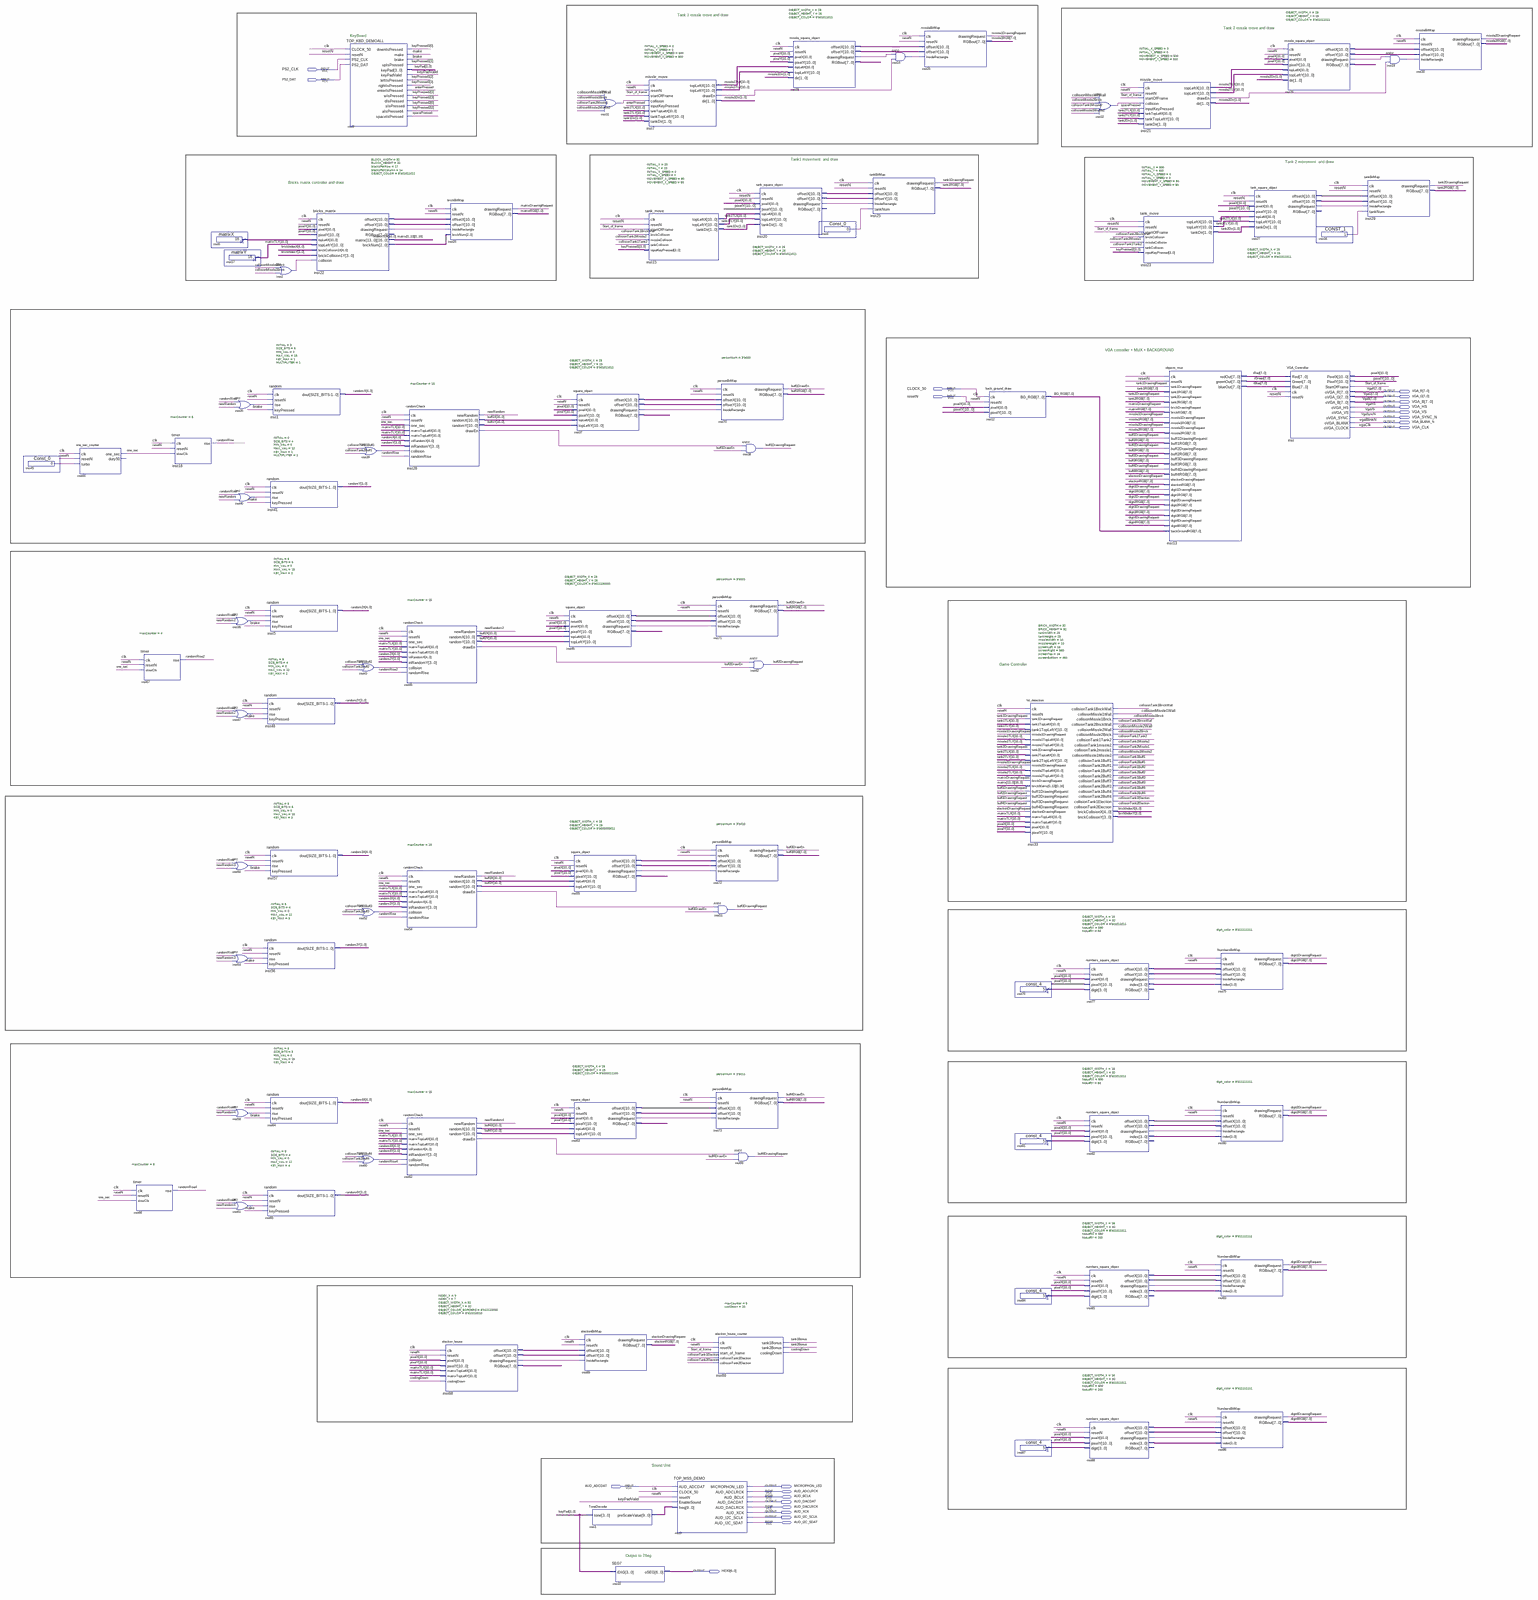
[diagram p0: schematic sheet, whole]
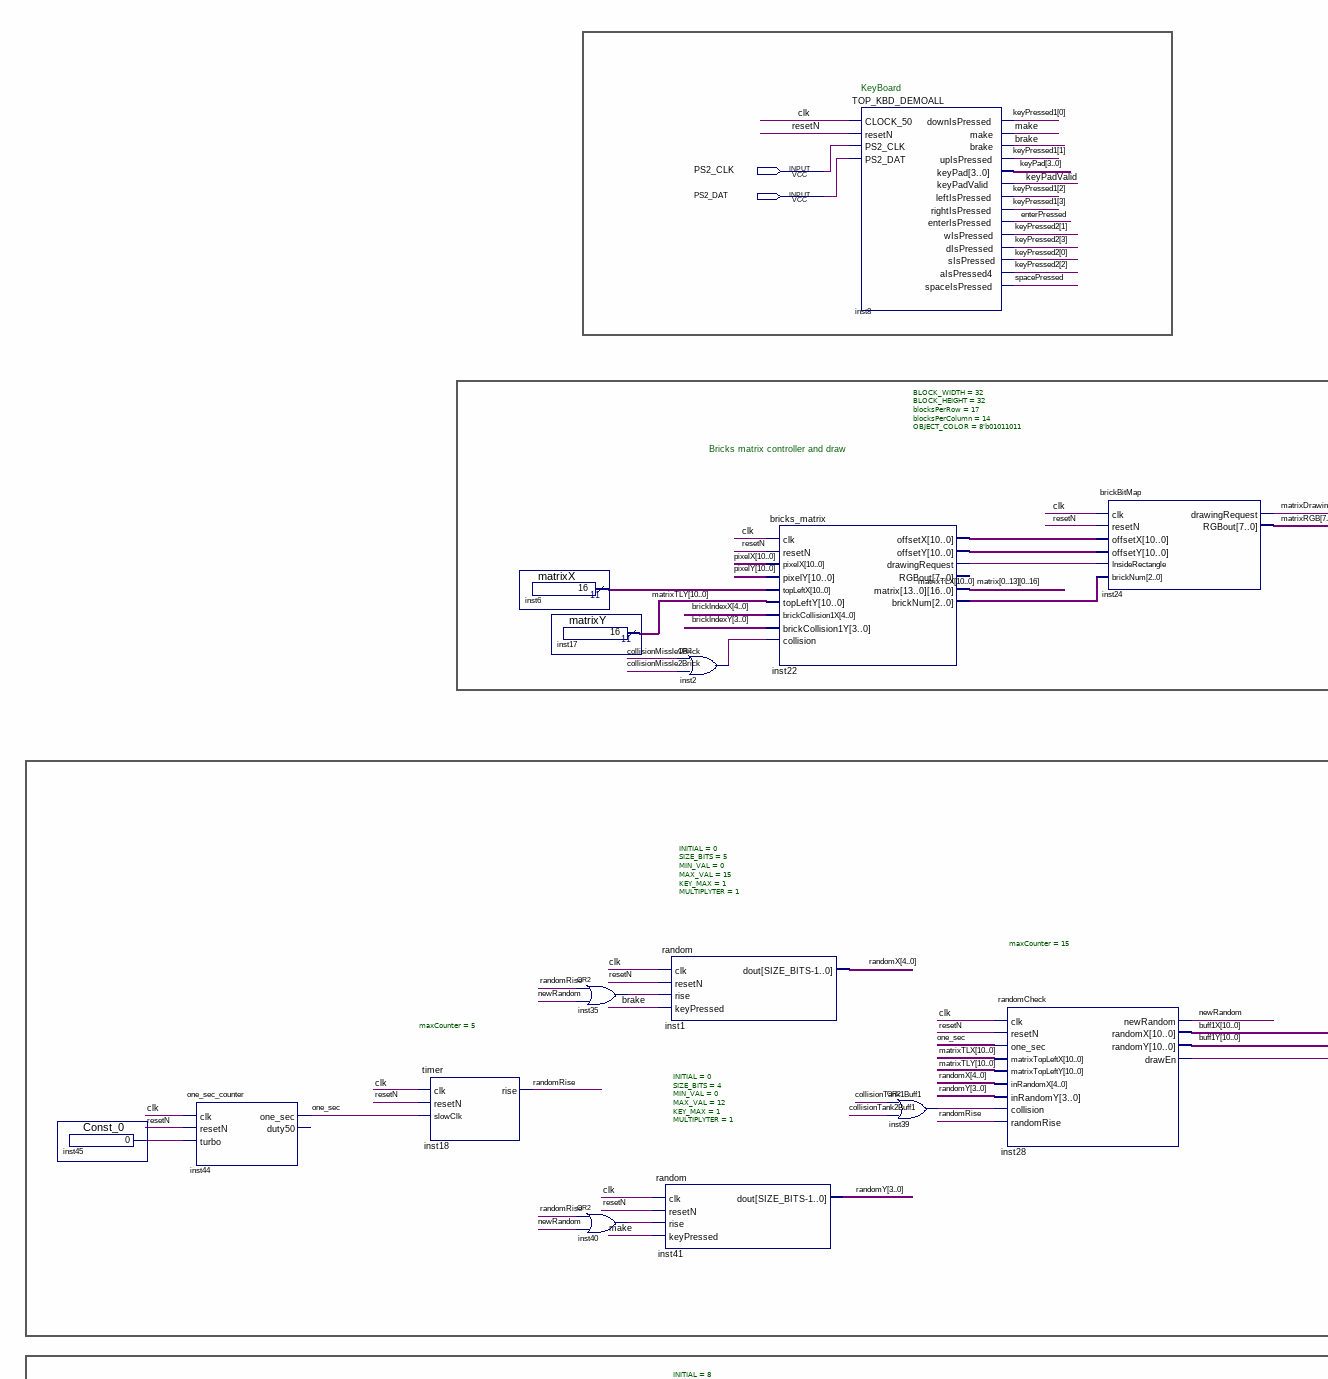
[diagram p1: schematic sheet, upper left part]
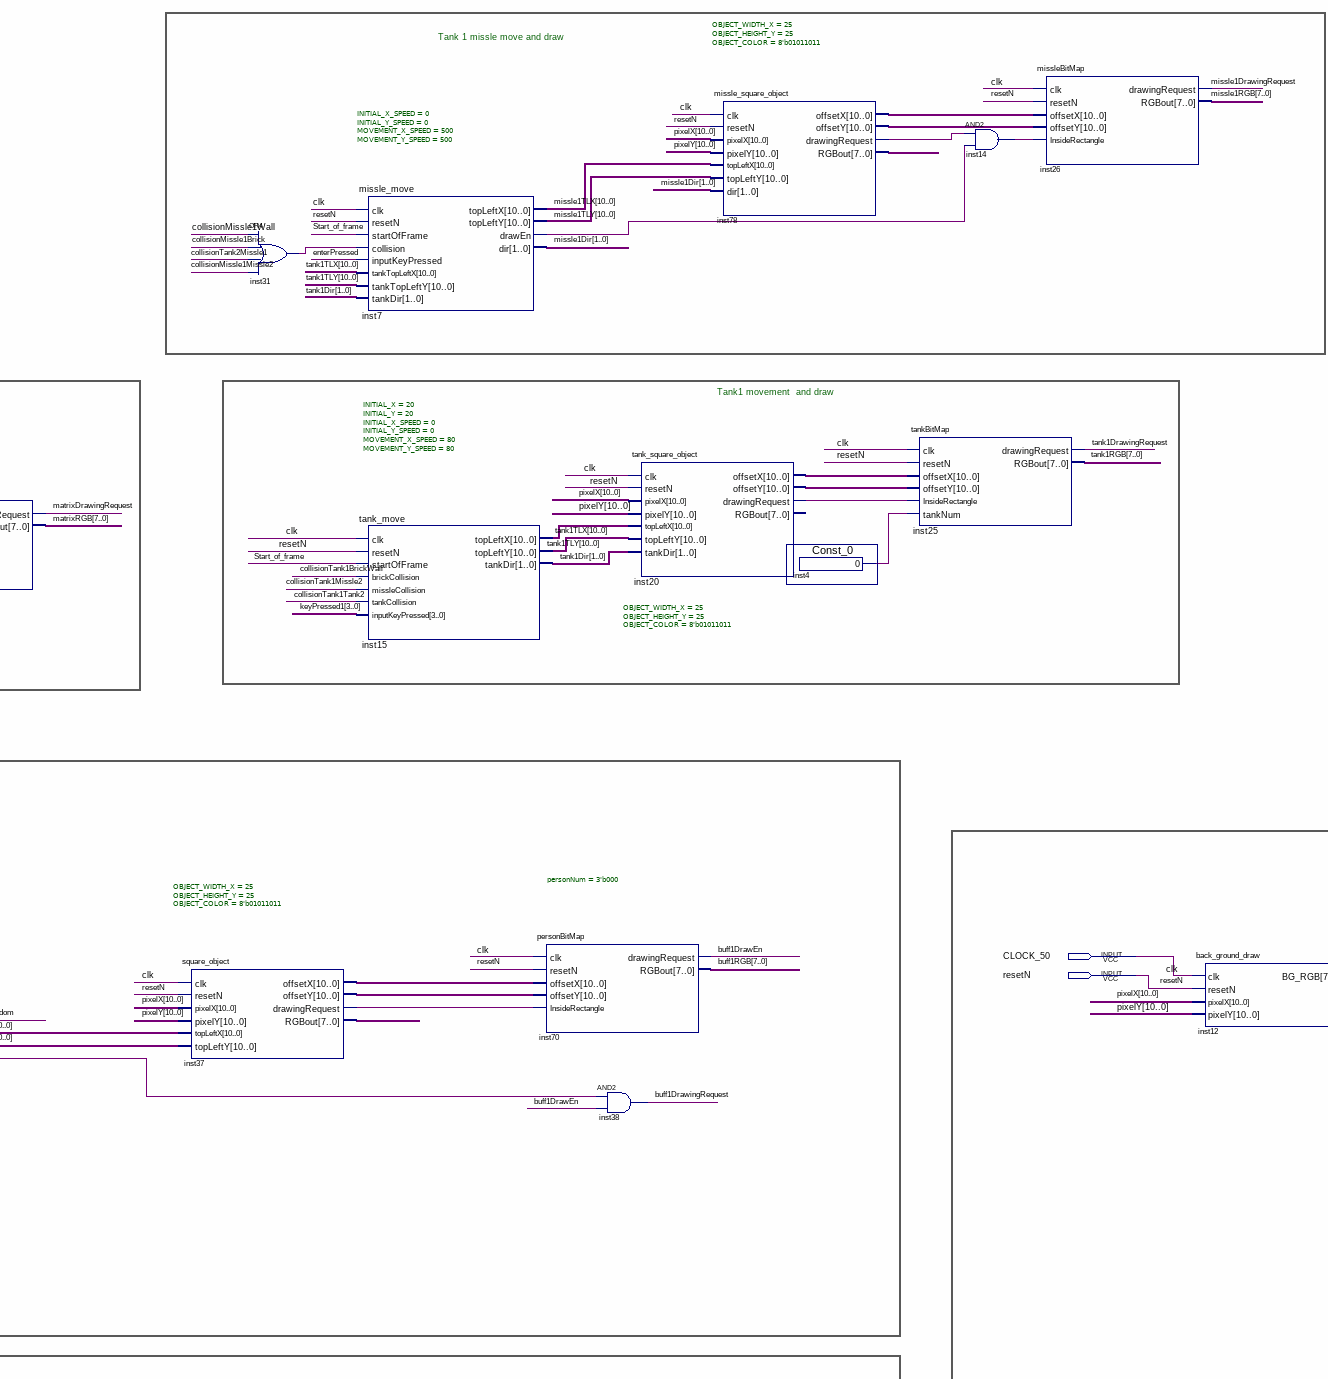
[diagram p2: schematic sheet, upper centre part]
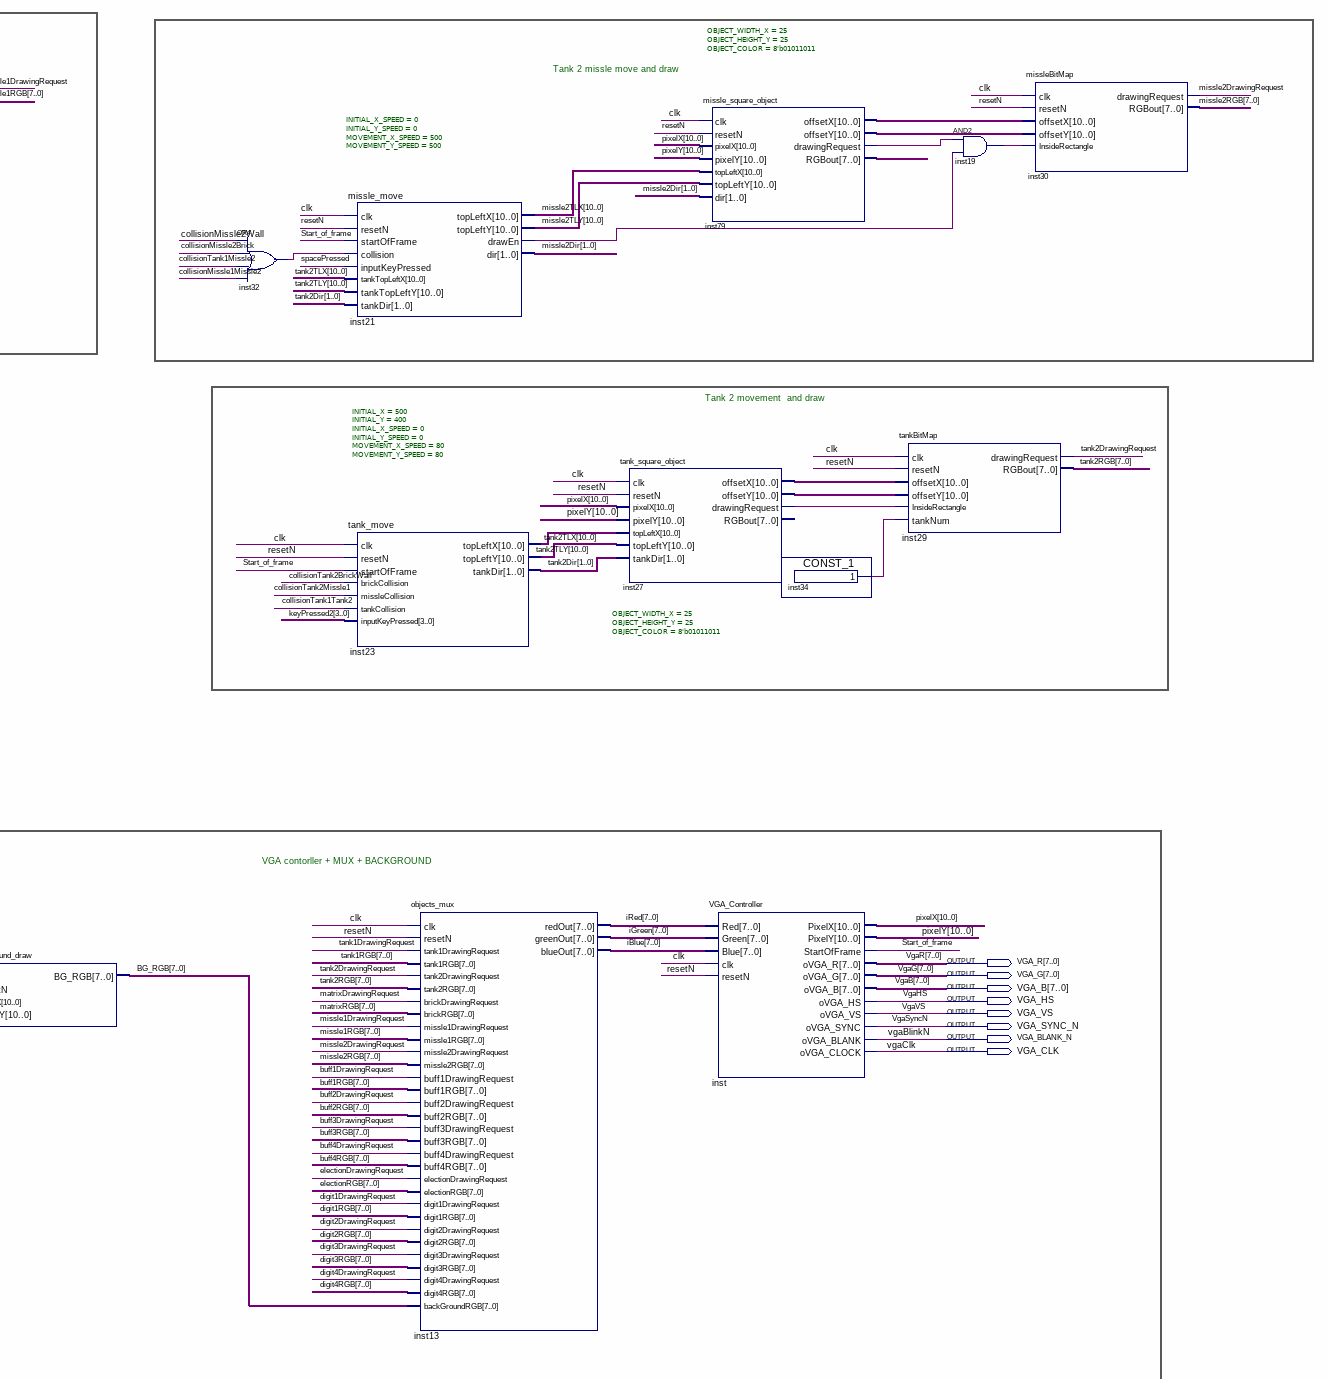
[diagram p3: schematic sheet, upper right part]
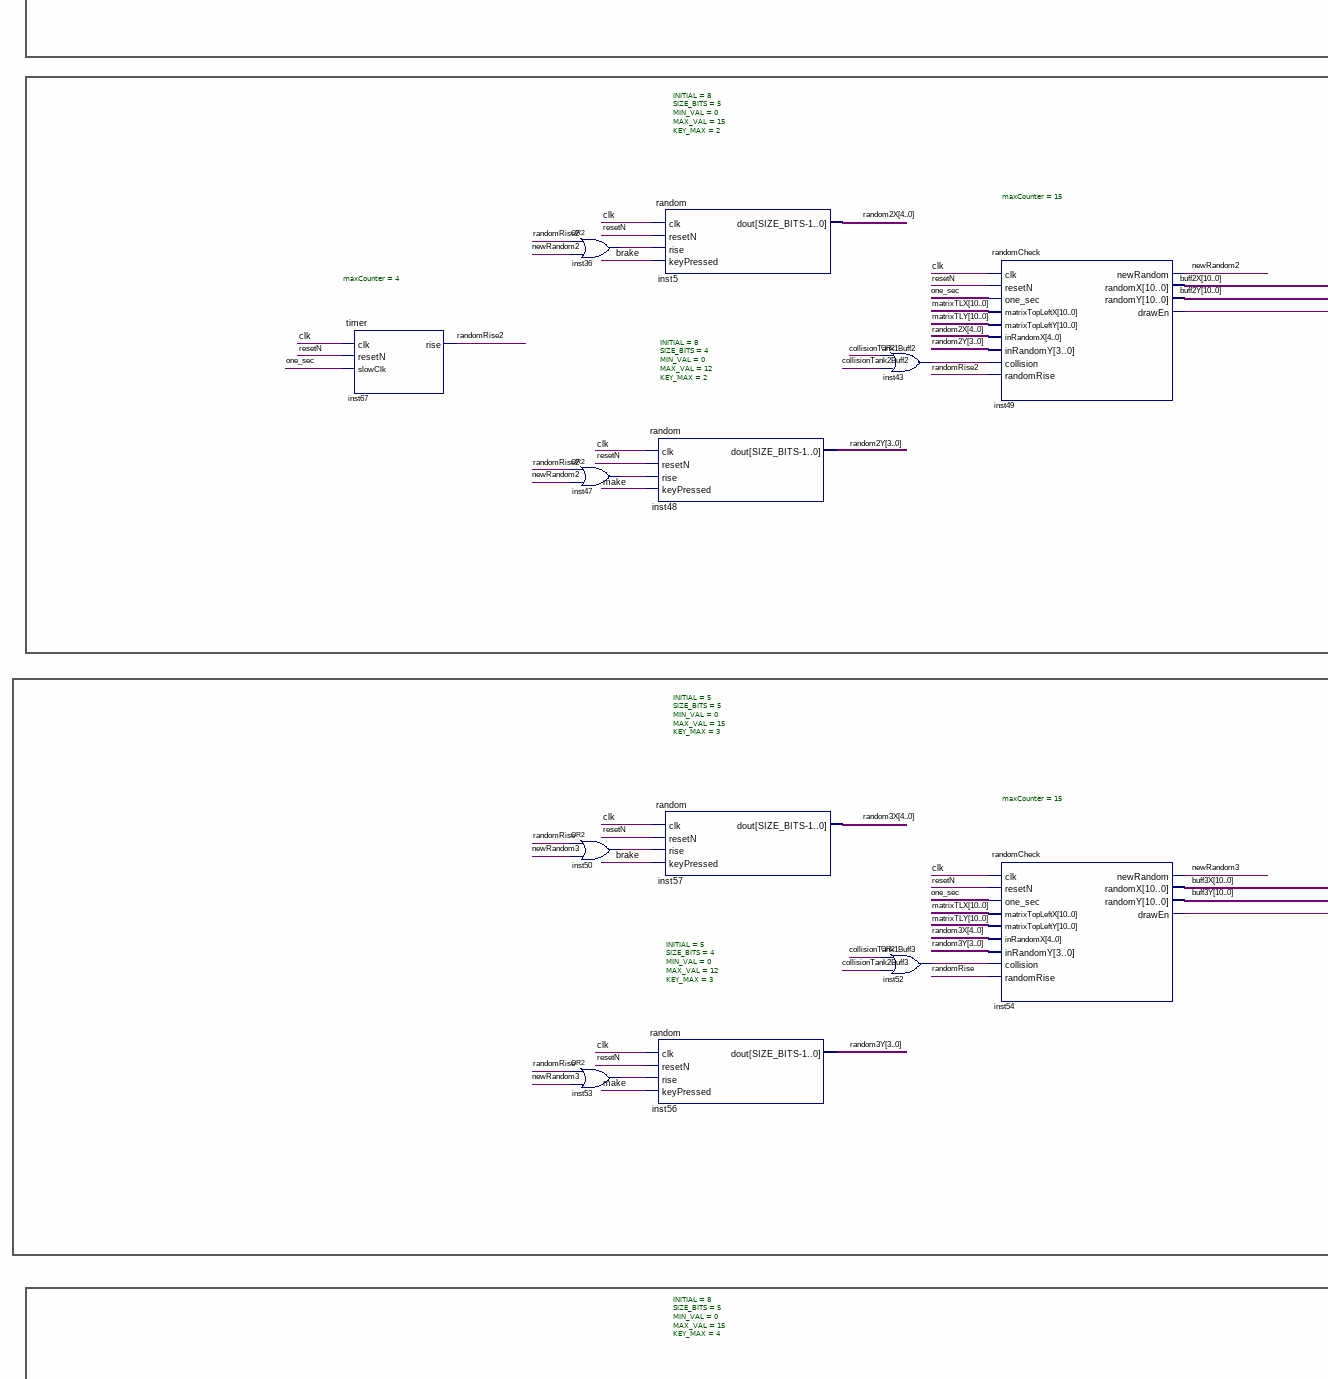
[diagram p4: schematic sheet, middle left part]
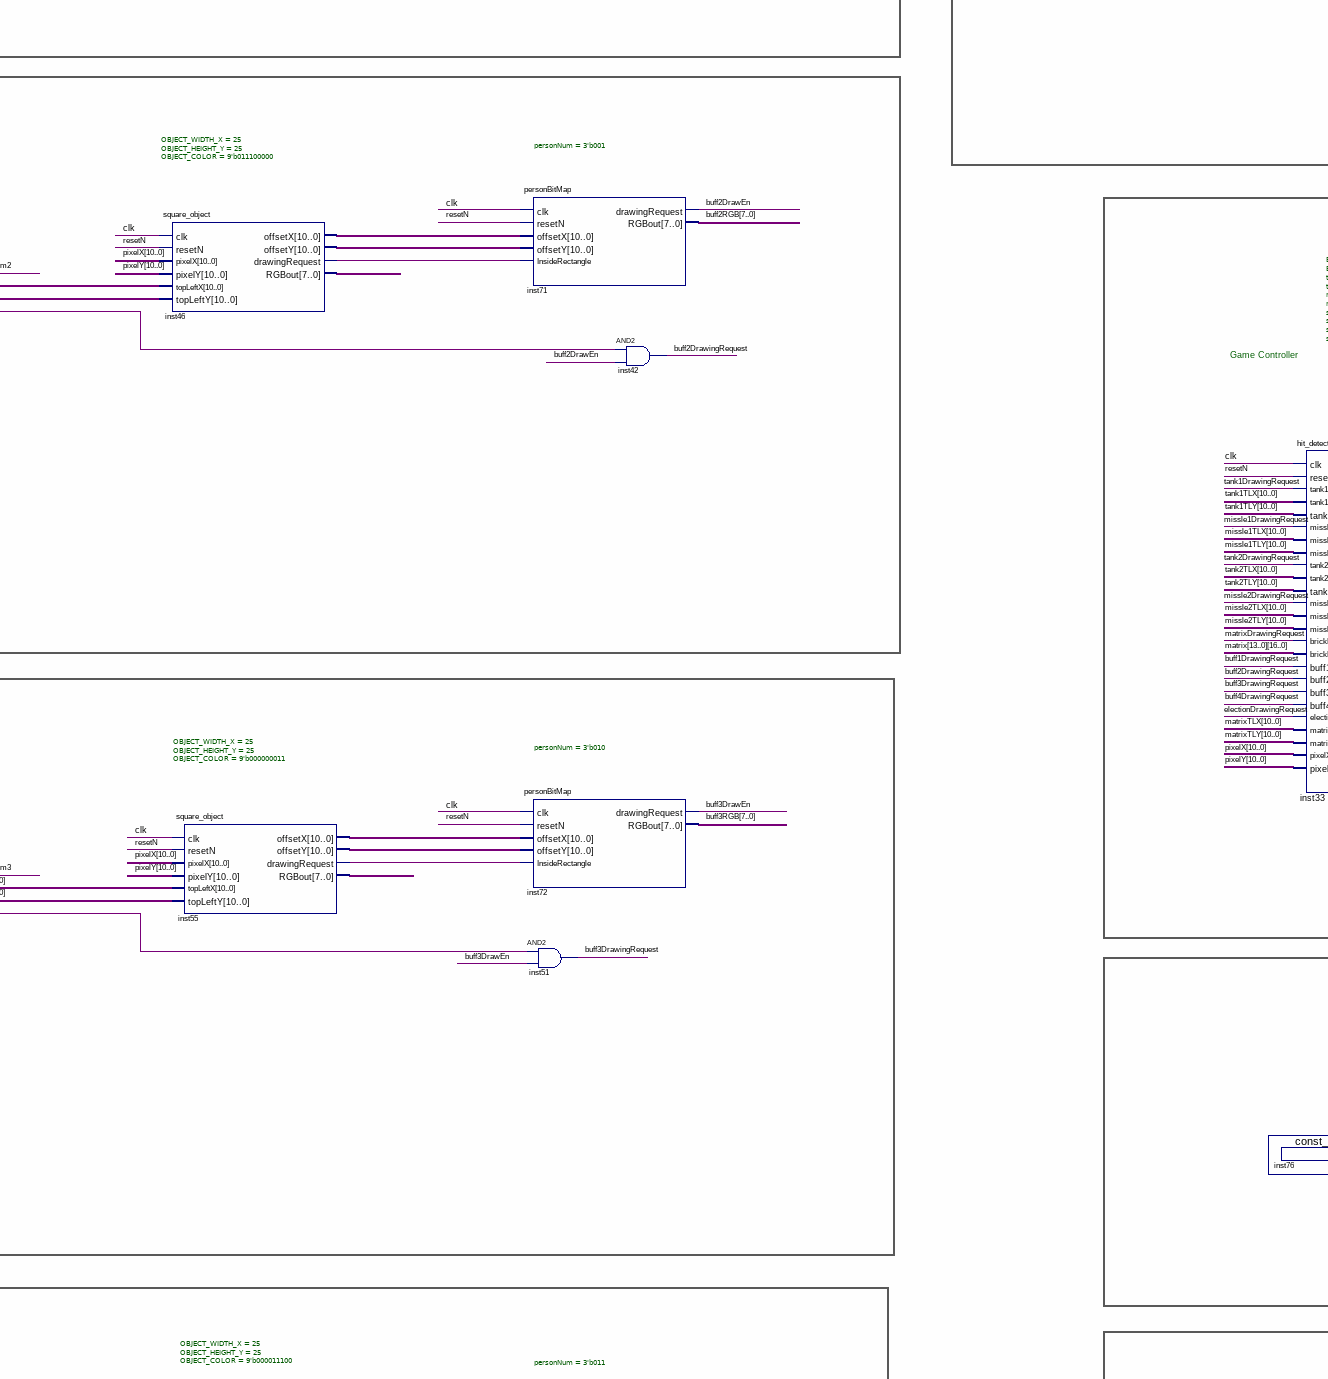
[diagram p5: schematic sheet, middle centre part]
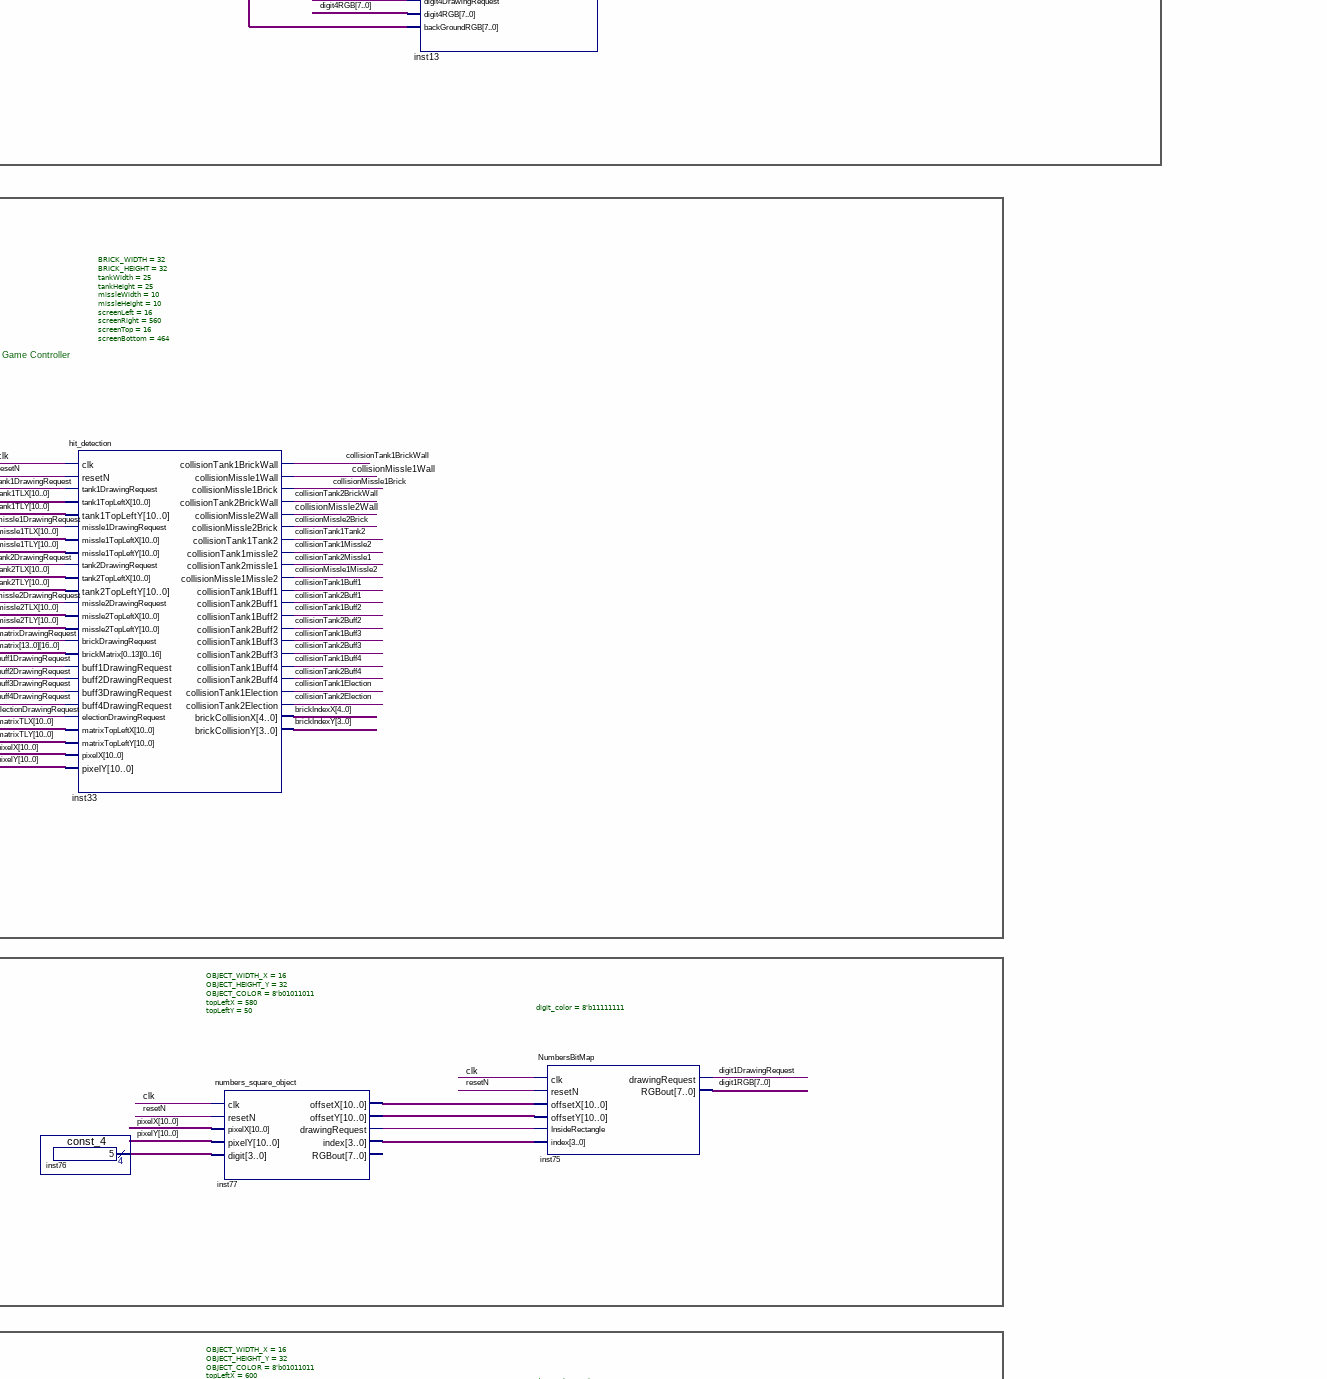
[diagram p6: schematic sheet, middle right part]
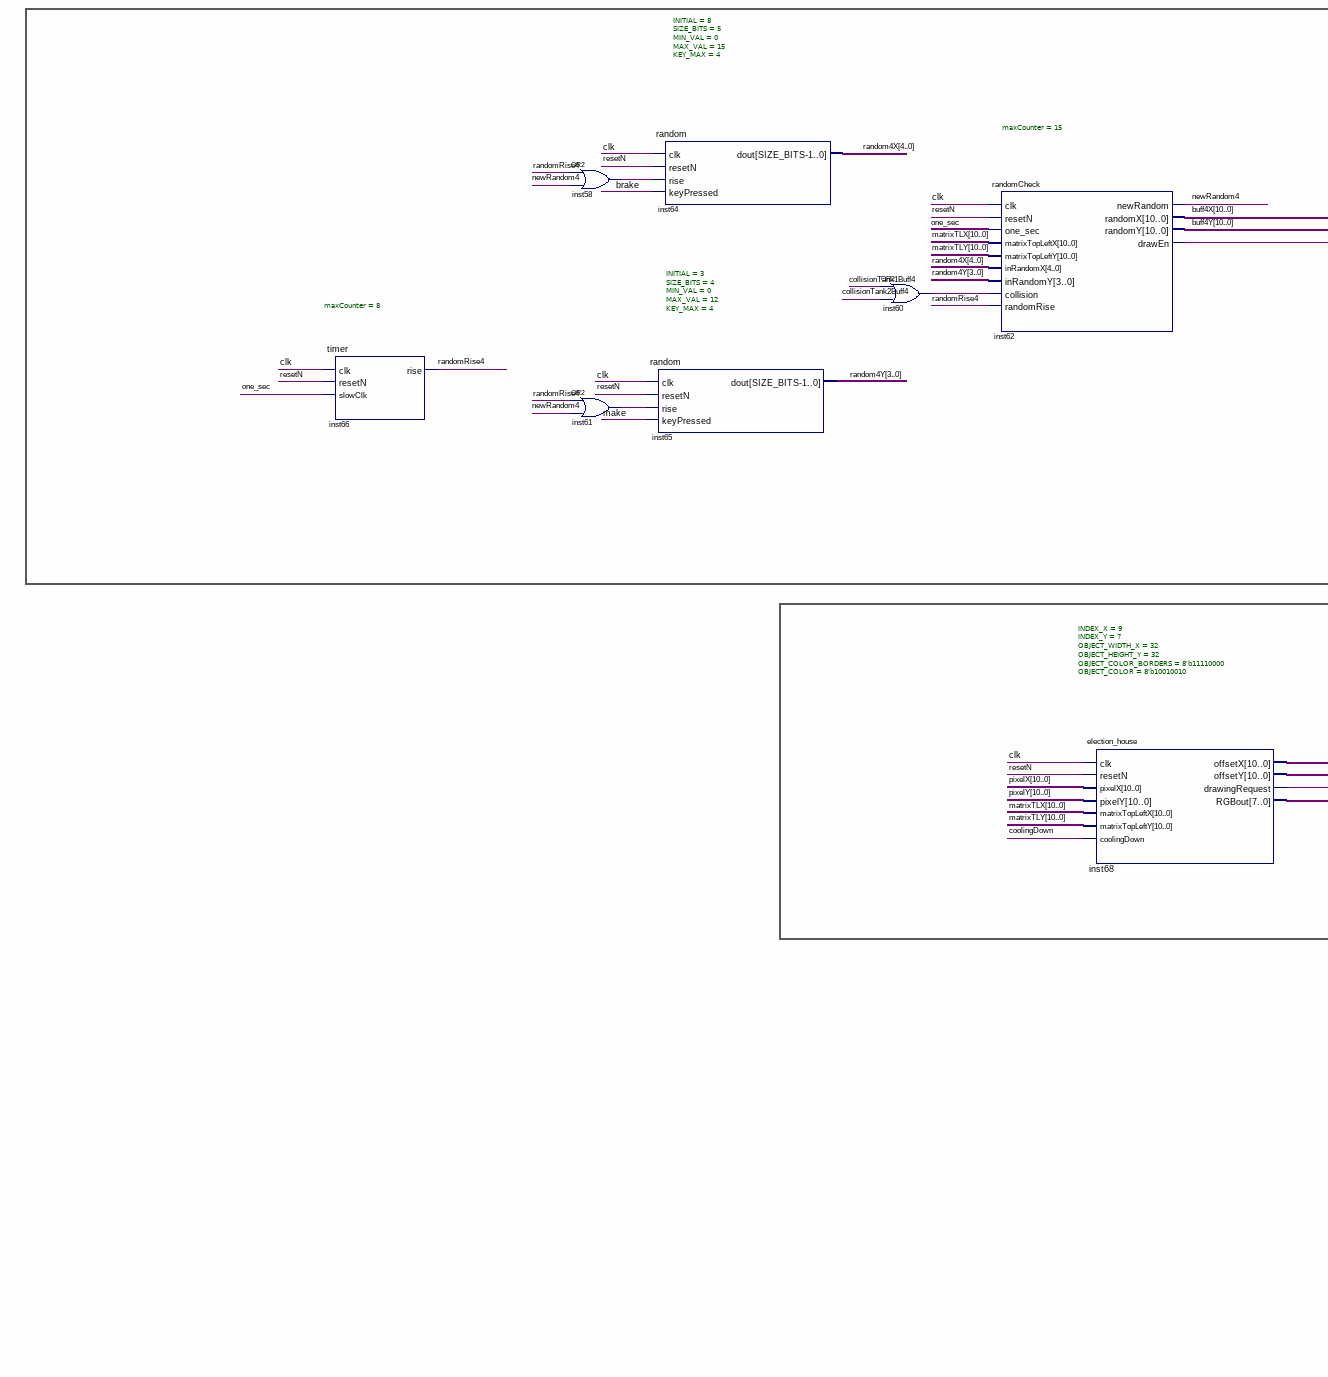
[diagram p7: schematic sheet, lower left part]
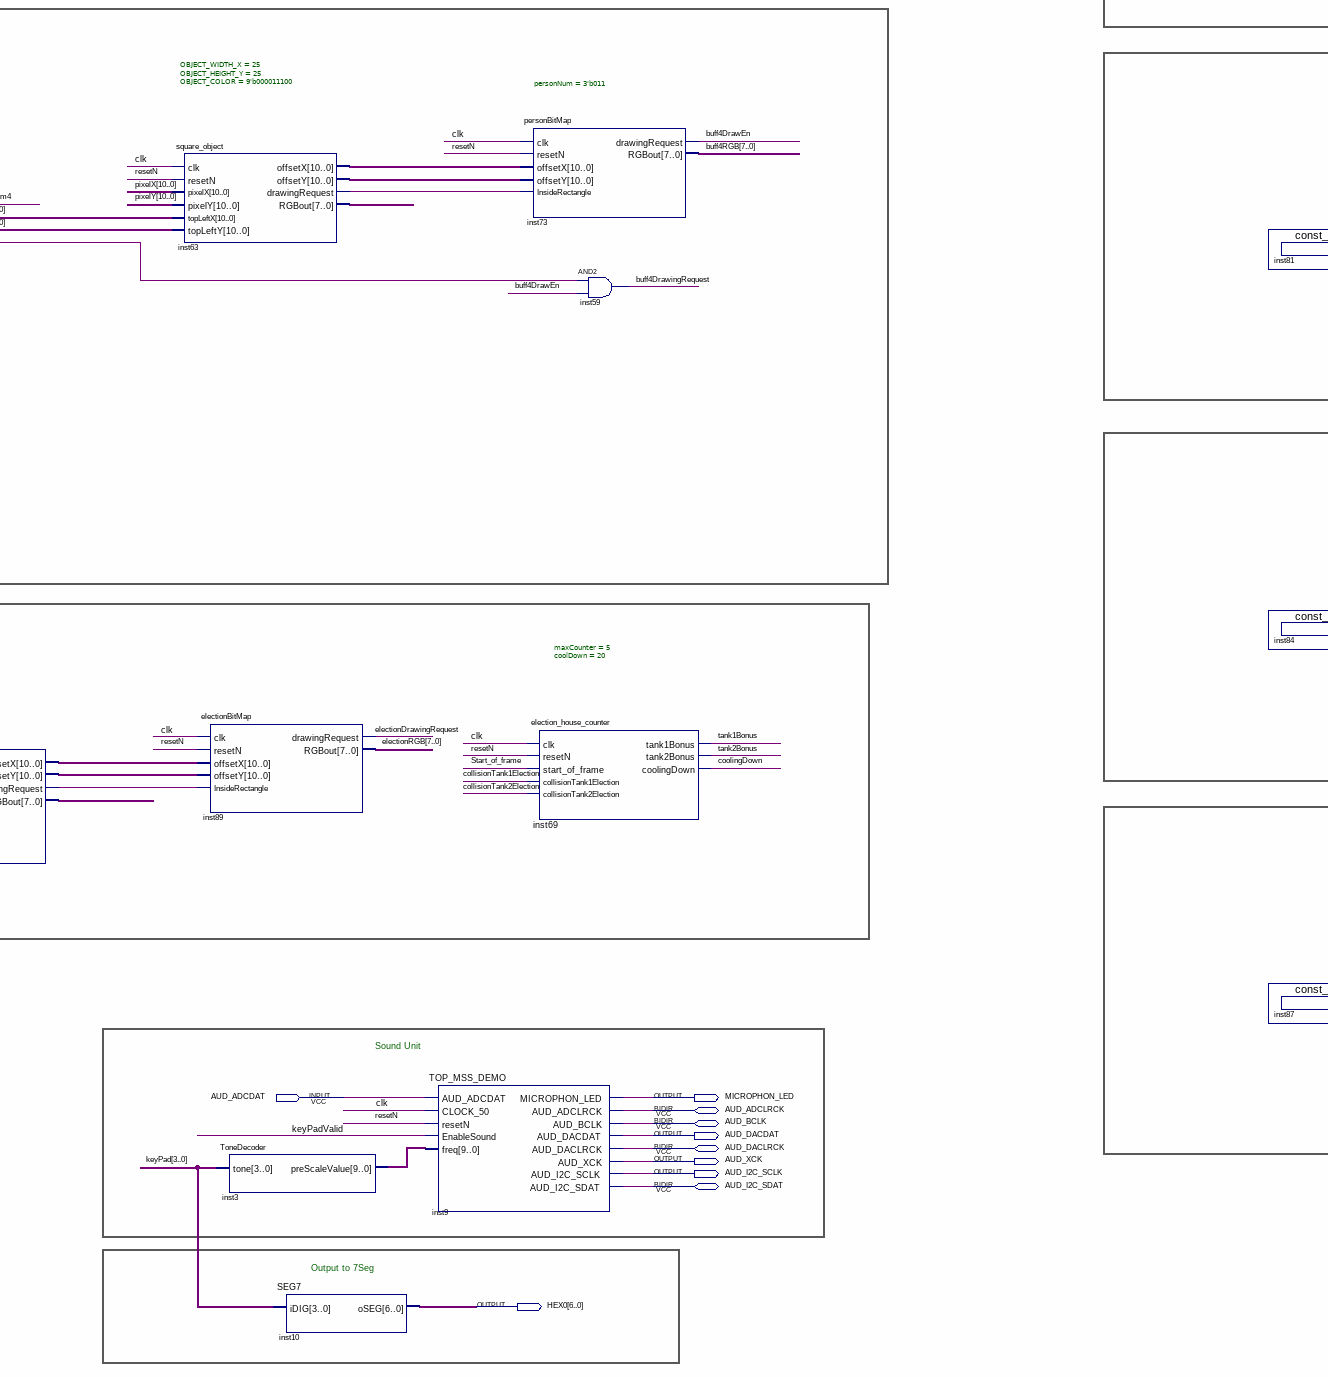
[diagram p8: schematic sheet, lower centre part]
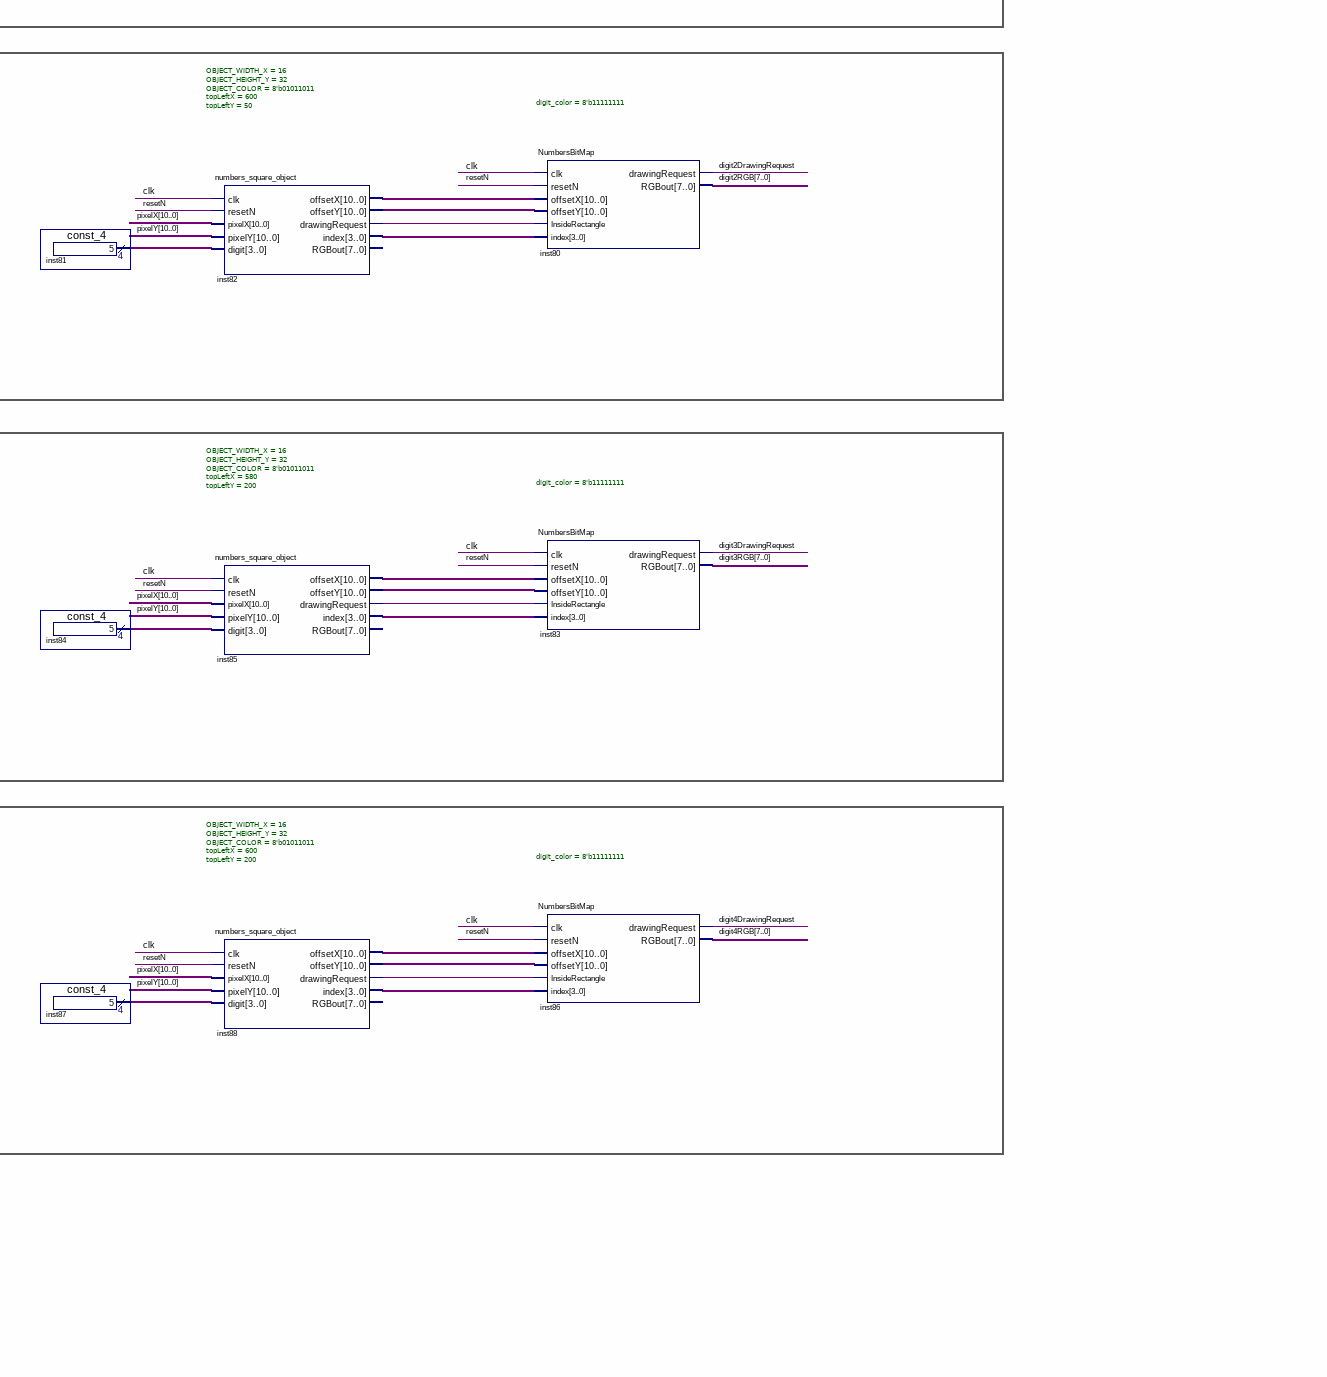
[diagram p9: schematic sheet, lower right part]
// Quartus schematic TOP_VGA.bdf as structural Verilog: 87 symbols, 22 pins
module TOP_VGA (
  input  PS2_CLK,
  input  PS2_DAT,
  input  CLOCK_50,
  input  resetN,
  input  AUD_ADCDAT,
  inout  AUD_ADCLRCK,
  inout  AUD_BCLK,
  inout  AUD_DACLRCK,
  inout  AUD_I2C_SDAT,
  output [7:0] VGA_R,
  output [7:0] VGA_G,
  output [7:0] VGA_B,
  output VGA_HS,
  output VGA_VS,
  output VGA_SYNC_N,
  output VGA_BLANK_N,
  output VGA_CLK,
  output MICROPHON_LED,
  output AUD_DACDAT,
  output AUD_XCK,
  output AUD_I2C_SCLK,
  output [6:0] HEX0
);

  wire brake, buff1DrawEn, buff1DrawingRequest, buff2DrawEn, buff2DrawingRequest, buff3DrawEn,
       buff3DrawingRequest, buff4DrawEn, buff4DrawingRequest, collisionMissle1Brick, collisionMissle1Missle2,
       collisionMissle1Wall, collisionMissle2Brick, collisionMissle2Wall, collisionTank1BrickWall,
       collisionTank1Buff1, collisionTank1Buff2, collisionTank1Buff3, collisionTank1Buff4,
       collisionTank1Election, collisionTank1Missle2, collisionTank1Tank2, collisionTank2BrickWall,
       collisionTank2Buff1, collisionTank2Buff2, collisionTank2Buff3, collisionTank2Buff4,
       collisionTank2Election, collisionTank2Missle1, coolingDown, digit1DrawingRequest,
       digit2DrawingRequest, digit3DrawingRequest, digit4DrawingRequest, electionDrawingRequest,
       enterPressed, inst2_out, inst4_result, inst7_drawen, inst14_out, inst19_out, inst20_drawingrequest,
       inst21_drawen, inst22_drawingrequest, inst27_drawingrequest, inst28_drawen, inst31_out, inst32_out,
       inst34_result, inst35_out, inst36_out, inst37_drawingrequest, inst39_out, inst40_out, inst43_out,
       inst45_result, inst46_drawingrequest, inst47_out, inst49_drawen, inst50_out, inst52_out, inst53_out,
       inst54_drawen, inst55_drawingrequest, inst58_out, inst60_out, inst61_out, inst62_drawen,
       inst63_drawingrequest, inst68_drawingrequest, inst77_drawingrequest, inst78_drawingrequest,
       inst79_drawingrequest, inst82_drawingrequest, inst85_drawingrequest, inst88_drawingrequest,
       keyPadValid, make, matrixDrawingRequest, missle1DrawingRequest, missle2DrawingRequest, newRandom,
       newRandom2, newRandom3, newRandom4, one_sec, randomRise, randomRise2, randomRise4, spacePressed,
       Start_of_frame, tank1Bonus, tank1DrawingRequest, tank2Bonus, tank2DrawingRequest;
  wire [1:0] missle1Dir, missle2Dir, tank1Dir, tank2Dir;
  wire [2:0] inst22_bricknum;
  wire [3:0] brickIndexY, inst76_result, inst77_index, inst81_result, inst82_index, inst84_result,
       inst85_index, inst87_result, inst88_index, keyPad, keyPressed1, keyPressed2, random2Y, random3Y,
       random4Y, randomY;
  wire [4:0] brickIndexX, random2X, random3X, random4X, randomX;
  wire [7:0] BG_RGB, buff1RGB, buff2RGB, buff3RGB, buff4RGB, digit1RGB, digit2RGB, digit3RGB, digit4RGB,
       electionRGB, iBlue, iGreen, inst37_rgbout, inst46_rgbout, inst55_rgbout, inst63_rgbout, inst68_rgbout,
       inst78_rgbout, inst79_rgbout, iRed, matrixRGB, missle1RGB, missle2RGB, tank1RGB, tank2RGB;
  wire [9:0] inst3_prescalevalue;
  wire [10:0] buff1X, buff1Y, buff2X, buff2Y, buff3X, buff3Y, buff4X, buff4Y, inst20_offsetx, inst20_offsety,
       inst22_offsetx, inst22_offsety, inst27_offsetx, inst27_offsety, inst37_offsetx, inst37_offsety,
       inst46_offsetx, inst46_offsety, inst55_offsetx, inst55_offsety, inst63_offsetx, inst63_offsety,
       inst68_offsetx, inst68_offsety, inst77_offsetx, inst77_offsety, inst78_offsetx, inst78_offsety,
       inst79_offsetx, inst79_offsety, inst82_offsetx, inst82_offsety, inst85_offsetx, inst85_offsety,
       inst88_offsetx, inst88_offsety, matrixTLX, matrixTLY, missle1TLX, missle1TLY, missle2TLX, missle2TLY,
       pixelX, pixelY, tank1TLX, tank1TLY, tank2TLX, tank2TLY;
  wire [16:0] matrix_0, matrix_1, matrix_2, matrix_3, matrix_4, matrix_5, matrix_6, matrix_7, matrix_8,
       matrix_9, matrix_10, matrix_11, matrix_12, matrix_13;

  Const_0 inst45 (.result(inst45_result));
  one_sec_counter inst44 (.clk(CLOCK_50), .resetN(resetN), .turbo(inst45_result), .one_sec(one_sec));  // open: duty50
  timer #(.maxCounter(4)) inst67 (.clk(CLOCK_50), .resetN(resetN), .slowClk(one_sec), .rise(randomRise2));
  timer #(.maxCounter(8)) inst66 (.clk(CLOCK_50), .resetN(resetN), .slowClk(one_sec), .rise(randomRise4));
  timer #(.maxCounter(5)) inst18 (.clk(CLOCK_50), .resetN(resetN), .slowClk(one_sec), .rise(randomRise));
  matrixX inst6 (.result(matrixTLX));
  matrixY inst17 (.result(matrixTLY));
  or inst36 (inst36_out, randomRise2, newRandom2);
  or inst47 (inst47_out, randomRise2, newRandom2);
  or inst50 (inst50_out, randomRise, newRandom3);
  or inst53 (inst53_out, randomRise, newRandom3);
  or inst58 (inst58_out, randomRise4, newRandom4);
  or inst61 (inst61_out, randomRise4, newRandom4);
  or inst35 (inst35_out, randomRise, newRandom);
  or inst40 (inst40_out, randomRise, newRandom);
  random #(.INITIAL(0), .SIZE_BITS(5), .MIN_VAL(0), .MAX_VAL(15), .KEY_MAX(1), .MULTIPLYTER(1)) inst1 (
    .clk(CLOCK_50), .resetN(resetN), .rise(inst35_out), .keyPressed(brake), .dout(randomX));
  random #(.INITIAL(0), .SIZE_BITS(4), .MIN_VAL(0), .MAX_VAL(12), .KEY_MAX(1), .MULTIPLYTER(1)) inst41 (
    .clk(CLOCK_50), .resetN(resetN), .rise(inst40_out), .keyPressed(make), .dout(randomY));
  random #(.INITIAL(8), .SIZE_BITS(5), .MIN_VAL(0), .MAX_VAL(15), .KEY_MAX(2)) inst5 (
    .clk(CLOCK_50), .resetN(resetN), .rise(inst36_out), .keyPressed(brake), .dout(random2X));
  random #(.INITIAL(8), .SIZE_BITS(4), .MIN_VAL(0), .MAX_VAL(12), .KEY_MAX(2)) inst48 (
    .clk(CLOCK_50), .resetN(resetN), .rise(inst47_out), .keyPressed(make), .dout(random2Y));
  random #(.INITIAL(5), .SIZE_BITS(5), .MIN_VAL(0), .MAX_VAL(15), .KEY_MAX(3)) inst57 (
    .clk(CLOCK_50), .resetN(resetN), .rise(inst50_out), .keyPressed(brake), .dout(random3X));
  random #(.INITIAL(5), .SIZE_BITS(4), .MIN_VAL(0), .MAX_VAL(12), .KEY_MAX(3)) inst56 (
    .clk(CLOCK_50), .resetN(resetN), .rise(inst53_out), .keyPressed(make), .dout(random3Y));
  random #(.INITIAL(8), .SIZE_BITS(5), .MIN_VAL(0), .MAX_VAL(15), .KEY_MAX(4)) inst64 (
    .clk(CLOCK_50), .resetN(resetN), .rise(inst58_out), .keyPressed(brake), .dout(random4X));
  random #(.INITIAL(3), .SIZE_BITS(4), .MIN_VAL(0), .MAX_VAL(12), .KEY_MAX(4)) inst65 (
    .clk(CLOCK_50), .resetN(resetN), .rise(inst61_out), .keyPressed(make), .dout(random4Y));
  or inst2 (inst2_out, collisionMissle1Brick, collisionMissle2Brick);
  bricks_matrix #(.BLOCK_WIDTH(32), .BLOCK_HEIGHT(32), .blocksPerRow(17), .blocksPerColumn(14), .OBJECT_COLOR(8'b01011011)) inst22 (
    .clk(CLOCK_50), .resetN(resetN), .pixelX(pixelX), .pixelY(pixelY), .topLeftX(matrixTLX),
    .topLeftY(matrixTLY), .brickCollision1X(brickIndexX), .brickCollision1Y(brickIndexY),
    .collision(inst2_out), .offsetX(inst22_offsetx), .offsetY(inst22_offsety),
    .drawingRequest(inst22_drawingrequest),
    .matrix({matrix_0[0], matrix_0[1], matrix_0[2], matrix_0[3], matrix_0[4], matrix_0[5], matrix_0[6], matrix_0[7], matrix_0[8], matrix_0[9], matrix_0[10], matrix_0[11], matrix_0[12], matrix_0[13], matrix_0[14], matrix_0[15], matrix_0[16], matrix_1[0], matrix_1[1], matrix_1[2], matrix_1[3], matrix_1[4], matrix_1[5], matrix_1[6], matrix_1[7], matrix_1[8], matrix_1[9], matrix_1[10], matrix_1[11], matrix_1[12], matrix_1[13], matrix_1[14], matrix_1[15], matrix_1[16], matrix_2[0], matrix_2[1], matrix_2[2], matrix_2[3], matrix_2[4], matrix_2[5], matrix_2[6], matrix_2[7], matrix_2[8], matrix_2[9], matrix_2[10], matrix_2[11], matrix_2[12], matrix_2[13], matrix_2[14], matrix_2[15], matrix_2[16], matrix_3[0], matrix_3[1], matrix_3[2], matrix_3[3], matrix_3[4], matrix_3[5], matrix_3[6], matrix_3[7], matrix_3[8], matrix_3[9], matrix_3[10], matrix_3[11], matrix_3[12], matrix_3[13], matrix_3[14], matrix_3[15], matrix_3[16], matrix_4[0], matrix_4[1], matrix_4[2], matrix_4[3], matrix_4[4], matrix_4[5], matrix_4[6], matrix_4[7], matrix_4[8], matrix_4[9], matrix_4[10], matrix_4[11], matrix_4[12], matrix_4[13], matrix_4[14], matrix_4[15], matrix_4[16], matrix_5[0], matrix_5[1], matrix_5[2], matrix_5[3], matrix_5[4], matrix_5[5], matrix_5[6], matrix_5[7], matrix_5[8], matrix_5[9], matrix_5[10], matrix_5[11], matrix_5[12], matrix_5[13], matrix_5[14], matrix_5[15], matrix_5[16], matrix_6[0], matrix_6[1], matrix_6[2], matrix_6[3], matrix_6[4], matrix_6[5], matrix_6[6], matrix_6[7], matrix_6[8], matrix_6[9], matrix_6[10], matrix_6[11], matrix_6[12], matrix_6[13], matrix_6[14], matrix_6[15], matrix_6[16], matrix_7[0], matrix_7[1], matrix_7[2], matrix_7[3], matrix_7[4], matrix_7[5], matrix_7[6], matrix_7[7], matrix_7[8], matrix_7[9], matrix_7[10], matrix_7[11], matrix_7[12], matrix_7[13], matrix_7[14], matrix_7[15], matrix_7[16], matrix_8[0], matrix_8[1], matrix_8[2], matrix_8[3], matrix_8[4], matrix_8[5], matrix_8[6], matrix_8[7], matrix_8[8], matrix_8[9], matrix_8[10], matrix_8[11], matrix_8[12], matrix_8[13], matrix_8[14], matrix_8[15], matrix_8[16], matrix_9[0], matrix_9[1], matrix_9[2], matrix_9[3], matrix_9[4], matrix_9[5], matrix_9[6], matrix_9[7], matrix_9[8], matrix_9[9], matrix_9[10], matrix_9[11], matrix_9[12], matrix_9[13], matrix_9[14], matrix_9[15], matrix_9[16], matrix_10[0], matrix_10[1], matrix_10[2], matrix_10[3], matrix_10[4], matrix_10[5], matrix_10[6], matrix_10[7], matrix_10[8], matrix_10[9], matrix_10[10], matrix_10[11], matrix_10[12], matrix_10[13], matrix_10[14], matrix_10[15], matrix_10[16], matrix_11[0], matrix_11[1], matrix_11[2], matrix_11[3], matrix_11[4], matrix_11[5], matrix_11[6], matrix_11[7], matrix_11[8], matrix_11[9], matrix_11[10], matrix_11[11], matrix_11[12], matrix_11[13], matrix_11[14], matrix_11[15], matrix_11[16], matrix_12[0], matrix_12[1], matrix_12[2], matrix_12[3], matrix_12[4], matrix_12[5], matrix_12[6], matrix_12[7], matrix_12[8], matrix_12[9], matrix_12[10], matrix_12[11], matrix_12[12], matrix_12[13], matrix_12[14], matrix_12[15], matrix_12[16], matrix_13[0], matrix_13[1], matrix_13[2], matrix_13[3], matrix_13[4], matrix_13[5], matrix_13[6], matrix_13[7], matrix_13[8], matrix_13[9], matrix_13[10], matrix_13[11], matrix_13[12], matrix_13[13], matrix_13[14], matrix_13[15], matrix_13[16]}),
    .brickNum(inst22_bricknum));  // open: RGBout
  TOP_KBD_DEMOALL inst8 (
    .CLOCK_50(CLOCK_50), .resetN(resetN), .PS2_CLK(PS2_CLK), .PS2_DAT(PS2_DAT),
    .downIsPressed(keyPressed1[0]), .make(make), .brake(brake), .upIsPressed(keyPressed1[1]),
    .keyPad(keyPad), .keyPadValid(keyPadValid), .leftIsPressed(keyPressed1[2]),
    .rightIsPressed(keyPressed1[3]), .enterIsPressed(enterPressed), .wIsPressed(keyPressed2[1]),
    .dIsPressed(keyPressed2[3]), .sIsPressed(keyPressed2[0]), .aIsPressed4(keyPressed2[2]),
    .spaceIsPressed(spacePressed));
  or inst39 (inst39_out, collisionTank1Buff1, collisionTank2Buff1);
  or inst43 (inst43_out, collisionTank1Buff2, collisionTank2Buff2);
  or inst52 (inst52_out, collisionTank1Buff3, collisionTank2Buff3);
  or inst60 (inst60_out, collisionTank1Buff4, collisionTank2Buff4);
  randomCheck #(.maxCounter(15)) inst28 (
    .clk(CLOCK_50), .resetN(resetN), .one_sec(one_sec), .matrixTopLeftX(matrixTLX),
    .matrixTopLeftY(matrixTLY), .inRandomX(randomX), .inRandomY(randomY), .collision(inst39_out),
    .randomRise(randomRise), .newRandom(newRandom), .randomX(buff1X), .randomY(buff1Y), .drawEn(inst28_drawen));
  randomCheck #(.maxCounter(15)) inst49 (
    .clk(CLOCK_50), .resetN(resetN), .one_sec(one_sec), .matrixTopLeftX(matrixTLX),
    .matrixTopLeftY(matrixTLY), .inRandomX(random2X), .inRandomY(random2Y), .collision(inst43_out),
    .randomRise(randomRise2), .newRandom(newRandom2), .randomX(buff2X), .randomY(buff2Y),
    .drawEn(inst49_drawen));
  randomCheck #(.maxCounter(15)) inst54 (
    .clk(CLOCK_50), .resetN(resetN), .one_sec(one_sec), .matrixTopLeftX(matrixTLX),
    .matrixTopLeftY(matrixTLY), .inRandomX(random3X), .inRandomY(random3Y), .collision(inst52_out),
    .randomRise(randomRise), .newRandom(newRandom3), .randomX(buff3X), .randomY(buff3Y),
    .drawEn(inst54_drawen));
  randomCheck #(.maxCounter(15)) inst62 (
    .clk(CLOCK_50), .resetN(resetN), .one_sec(one_sec), .matrixTopLeftX(matrixTLX),
    .matrixTopLeftY(matrixTLY), .inRandomX(random4X), .inRandomY(random4Y), .collision(inst60_out),
    .randomRise(randomRise4), .newRandom(newRandom4), .randomX(buff4X), .randomY(buff4Y),
    .drawEn(inst62_drawen));
  brickBitMap inst24 (
    .clk(CLOCK_50), .resetN(resetN), .offsetX(inst22_offsetx), .offsetY(inst22_offsety),
    .InsideRectangle(inst22_drawingrequest), .brickNum(inst22_bricknum),
    .drawingRequest(matrixDrawingRequest), .RGBout(matrixRGB));
  election_house #(.INDEX_X(9), .INDEX_Y(7), .OBJECT_WIDTH_X(32), .OBJECT_HEIGHT_Y(32), .OBJECT_COLOR_BORDERS(8'b11110000), .OBJECT_COLOR(8'b10010010)) inst68 (
    .clk(CLOCK_50), .resetN(resetN), .pixelX(pixelX), .pixelY(pixelY), .matrixTopLeftX(matrixTLX),
    .matrixTopLeftY(matrixTLY), .coolingDown(coolingDown), .offsetX(inst68_offsetx),
    .offsetY(inst68_offsety), .drawingRequest(inst68_drawingrequest), .RGBout(inst68_rgbout));
  square_object #(.OBJECT_WIDTH_X(25), .OBJECT_HEIGHT_Y(25), .OBJECT_COLOR(8'b01011011)) inst37 (
    .clk(CLOCK_50), .resetN(resetN), .pixelX(pixelX), .pixelY(pixelY), .topLeftX(buff1X), .topLeftY(buff1Y),
    .offsetX(inst37_offsetx), .offsetY(inst37_offsety), .drawingRequest(inst37_drawingrequest),
    .RGBout(inst37_rgbout));
  square_object #(.OBJECT_WIDTH_X(25), .OBJECT_HEIGHT_Y(25), .OBJECT_COLOR(9'b011100000)) inst46 (
    .clk(CLOCK_50), .resetN(resetN), .pixelX(pixelX), .pixelY(pixelY), .topLeftX(buff2X), .topLeftY(buff2Y),
    .offsetX(inst46_offsetx), .offsetY(inst46_offsety), .drawingRequest(inst46_drawingrequest),
    .RGBout(inst46_rgbout));
  square_object #(.OBJECT_WIDTH_X(25), .OBJECT_HEIGHT_Y(25), .OBJECT_COLOR(9'b000000011)) inst55 (
    .clk(CLOCK_50), .resetN(resetN), .pixelX(pixelX), .pixelY(pixelY), .topLeftX(buff3X), .topLeftY(buff3Y),
    .offsetX(inst55_offsetx), .offsetY(inst55_offsety), .drawingRequest(inst55_drawingrequest),
    .RGBout(inst55_rgbout));
  square_object #(.OBJECT_WIDTH_X(25), .OBJECT_HEIGHT_Y(25), .OBJECT_COLOR(9'b000011100)) inst63 (
    .clk(CLOCK_50), .resetN(resetN), .pixelX(pixelX), .pixelY(pixelY), .topLeftX(buff4X), .topLeftY(buff4Y),
    .offsetX(inst63_offsetx), .offsetY(inst63_offsety), .drawingRequest(inst63_drawingrequest),
    .RGBout(inst63_rgbout));
  electionBitMap inst89 (
    .clk(CLOCK_50), .resetN(resetN), .offsetX(inst68_offsetx), .offsetY(inst68_offsety),
    .InsideRectangle(inst68_drawingrequest), .drawingRequest(electionDrawingRequest), .RGBout(electionRGB));
  or inst31 (inst31_out, collisionMissle1Wall, collisionMissle1Brick, collisionTank2Missle1, collisionMissle1Missle2);
  ToneDecoder inst3 (.tone(keyPad), .preScaleValue(inst3_prescalevalue));
  SEG7 inst10 (.iDIG(keyPad), .oSEG(HEX0));
  missle_move #(.INITIAL_X_SPEED(0), .INITIAL_Y_SPEED(0), .MOVEMENT_X_SPEED(500), .MOVEMENT_Y_SPEED(500)) inst7 (
    .clk(CLOCK_50), .resetN(resetN), .startOfFrame(Start_of_frame), .collision(inst31_out),
    .inputKeyPressed(enterPressed), .tankTopLeftX(tank1TLX), .tankTopLeftY(tank1TLY), .tankDir(tank1Dir),
    .topLeftX(missle1TLX), .topLeftY(missle1TLY), .drawEn(inst7_drawen), .dir(missle1Dir));
  tank_move #(.INITIAL_X(20), .INITIAL_Y(20), .INITIAL_X_SPEED(0), .INITIAL_Y_SPEED(0), .MOVEMENT_X_SPEED(80), .MOVEMENT_Y_SPEED(80)) inst15 (
    .clk(CLOCK_50), .resetN(resetN), .startOfFrame(Start_of_frame), .brickCollision(collisionTank1BrickWall),
    .missleCollision(collisionTank1Missle2), .tankCollision(collisionTank1Tank2),
    .inputKeyPressed(keyPressed1), .topLeftX(tank1TLX), .topLeftY(tank1TLY), .tankDir(tank1Dir));
  TOP_MSS_DEMO inst9 (
    .AUD_ADCDAT(AUD_ADCDAT), .CLOCK_50(CLOCK_50), .resetN(resetN), .EnableSound(keyPadValid),
    .freq(inst3_prescalevalue), .MICROPHON_LED(MICROPHON_LED), .AUD_DACDAT(AUD_DACDAT), .AUD_XCK(AUD_XCK),
    .AUD_I2C_SCLK(AUD_I2C_SCLK), .AUD_ADCLRCK(AUD_ADCLRCK), .AUD_BCLK(AUD_BCLK), .AUD_DACLRCK(AUD_DACLRCK),
    .AUD_I2C_SDAT(AUD_I2C_SDAT));
  personBitMap #(.personNum(3'b000)) inst70 (
    .clk(CLOCK_50), .resetN(resetN), .offsetX(inst37_offsetx), .offsetY(inst37_offsety),
    .InsideRectangle(inst37_drawingrequest), .drawingRequest(buff1DrawEn), .RGBout(buff1RGB));
  personBitMap #(.personNum(3'b001)) inst71 (
    .clk(CLOCK_50), .resetN(resetN), .offsetX(inst46_offsetx), .offsetY(inst46_offsety),
    .InsideRectangle(inst46_drawingrequest), .drawingRequest(buff2DrawEn), .RGBout(buff2RGB));
  personBitMap #(.personNum(3'b010)) inst72 (
    .clk(CLOCK_50), .resetN(resetN), .offsetX(inst55_offsetx), .offsetY(inst55_offsety),
    .InsideRectangle(inst55_drawingrequest), .drawingRequest(buff3DrawEn), .RGBout(buff3RGB));
  and inst51 (buff3DrawingRequest, inst54_drawen, buff3DrawEn);
  personBitMap #(.personNum(3'b011)) inst73 (
    .clk(CLOCK_50), .resetN(resetN), .offsetX(inst63_offsetx), .offsetY(inst63_offsety),
    .InsideRectangle(inst63_drawingrequest), .drawingRequest(buff4DrawEn), .RGBout(buff4RGB));
  election_house_counter #(.maxCounter(5), .coolDown(20)) inst69 (
    .clk(CLOCK_50), .resetN(resetN), .start_of_frame(Start_of_frame),
    .collisionTank1Election(collisionTank1Election), .collisionTank2Election(collisionTank2Election),
    .tank1Bonus(tank1Bonus), .tank2Bonus(tank2Bonus), .coolingDown(coolingDown));
  and inst38 (buff1DrawingRequest, inst28_drawen, buff1DrawEn);
  and inst59 (buff4DrawingRequest, inst62_drawen, buff4DrawEn);
  tank_square_object #(.OBJECT_WIDTH_X(25), .OBJECT_HEIGHT_Y(25), .OBJECT_COLOR(8'b01011011)) inst20 (
    .clk(CLOCK_50), .resetN(resetN), .pixelX(pixelX), .pixelY(pixelY), .topLeftX(tank1TLX),
    .topLeftY(tank1TLY), .tankDir(tank1Dir), .offsetX(inst20_offsetx), .offsetY(inst20_offsety),
    .drawingRequest(inst20_drawingrequest));  // open: RGBout
  and inst42 (buff2DrawingRequest, inst49_drawen, buff2DrawEn);
  missle_square_object #(.OBJECT_WIDTH_X(25), .OBJECT_HEIGHT_Y(25), .OBJECT_COLOR(8'b01011011)) inst78 (
    .clk(CLOCK_50), .resetN(resetN), .pixelX(pixelX), .pixelY(pixelY), .topLeftX(missle1TLX),
    .topLeftY(missle1TLY), .dir(missle1Dir), .offsetX(inst78_offsetx), .offsetY(inst78_offsety),
    .drawingRequest(inst78_drawingrequest), .RGBout(inst78_rgbout));
  Const_0 inst4 (.result(inst4_result));
  tankBitMap inst25 (
    .clk(CLOCK_50), .resetN(resetN), .offsetX(inst20_offsetx), .offsetY(inst20_offsety),
    .InsideRectangle(inst20_drawingrequest), .tankNum(inst4_result), .drawingRequest(tank1DrawingRequest),
    .RGBout(tank1RGB));
  and inst14 (inst14_out, inst78_drawingrequest, inst7_drawen);
  missleBitMap inst26 (
    .clk(CLOCK_50), .resetN(resetN), .offsetX(inst78_offsetx), .offsetY(inst78_offsety),
    .InsideRectangle(inst14_out), .drawingRequest(missle1DrawingRequest), .RGBout(missle1RGB));
  back_ground_draw inst12 (.clk(CLOCK_50), .resetN(resetN), .pixelX(pixelX), .pixelY(pixelY), .BG_RGB(BG_RGB));
  const_4 inst76 (.result(inst76_result));
  const_4 inst81 (.result(inst81_result));
  const_4 inst84 (.result(inst84_result));
  const_4 inst87 (.result(inst87_result));
  hit_detection #(.BRICK_WIDTH(32), .BRICK_HEIGHT(32), .tankWidth(25), .tankHeight(25), .missleWidth(10), .missleHeight(10), .screenLeft(16), .screenRight(560), .screenTop(16), .screenBottom(464)) inst33 (
    .clk(CLOCK_50), .resetN(resetN), .tank1DrawingRequest(tank1DrawingRequest), .tank1TopLeftX(tank1TLX),
    .tank1TopLeftY(tank1TLY), .missle1DrawingRequest(missle1DrawingRequest), .missle1TopLeftX(missle1TLX),
    .missle1TopLeftY(missle1TLY), .tank2DrawingRequest(tank2DrawingRequest), .tank2TopLeftX(tank2TLX),
    .tank2TopLeftY(tank2TLY), .missle2DrawingRequest(missle2DrawingRequest), .missle2TopLeftX(missle2TLX),
    .missle2TopLeftY(missle2TLY), .brickDrawingRequest(matrixDrawingRequest),
    .brickMatrix({matrix_13, matrix_12, matrix_11, matrix_10, matrix_9, matrix_8, matrix_7, matrix_6, matrix_5, matrix_4, matrix_3, matrix_2, matrix_1, matrix_0}),
    .buff1DrawingRequest(buff1DrawingRequest), .buff2DrawingRequest(buff2DrawingRequest),
    .buff3DrawingRequest(buff3DrawingRequest), .buff4DrawingRequest(buff4DrawingRequest),
    .electionDrawingRequest(electionDrawingRequest), .matrixTopLeftX(matrixTLX), .matrixTopLeftY(matrixTLY),
    .pixelX(pixelX), .pixelY(pixelY), .collisionTank1BrickWall(collisionTank1BrickWall),
    .collisionMissle1Wall(collisionMissle1Wall), .collisionMissle1Brick(collisionMissle1Brick),
    .collisionTank2BrickWall(collisionTank2BrickWall), .collisionMissle2Wall(collisionMissle2Wall),
    .collisionMissle2Brick(collisionMissle2Brick), .collisionTank1Tank2(collisionTank1Tank2),
    .collisionTank1missle2(collisionTank1Missle2), .collisionTank2missle1(collisionTank2Missle1),
    .collisionMissle1Missle2(collisionMissle1Missle2), .collisionTank1Buff1(collisionTank1Buff1),
    .collisionTank2Buff1(collisionTank2Buff1), .collisionTank1Buff2(collisionTank1Buff2),
    .collisionTank2Buff2(collisionTank2Buff2), .collisionTank1Buff3(collisionTank1Buff3),
    .collisionTank2Buff3(collisionTank2Buff3), .collisionTank1Buff4(collisionTank1Buff4),
    .collisionTank2Buff4(collisionTank2Buff4), .collisionTank1Election(collisionTank1Election),
    .collisionTank2Election(collisionTank2Election), .brickCollisionX(brickIndexX),
    .brickCollisionY(brickIndexY));
  or inst32 (inst32_out, collisionMissle2Wall, collisionMissle2Brick, collisionTank1Missle2, collisionMissle1Missle2);
  numbers_square_object #(.OBJECT_WIDTH_X(16), .OBJECT_HEIGHT_Y(32), .OBJECT_COLOR(8'b01011011), .topLeftX(580), .topLeftY(50)) inst77 (
    .clk(CLOCK_50), .resetN(resetN), .pixelX(pixelX), .pixelY(pixelY), .digit(inst76_result),
    .offsetX(inst77_offsetx), .offsetY(inst77_offsety), .drawingRequest(inst77_drawingrequest),
    .index(inst77_index));  // open: RGBout
  numbers_square_object #(.OBJECT_WIDTH_X(16), .OBJECT_HEIGHT_Y(32), .OBJECT_COLOR(8'b01011011), .topLeftX(600), .topLeftY(50)) inst82 (
    .clk(CLOCK_50), .resetN(resetN), .pixelX(pixelX), .pixelY(pixelY), .digit(inst81_result),
    .offsetX(inst82_offsetx), .offsetY(inst82_offsety), .drawingRequest(inst82_drawingrequest),
    .index(inst82_index));  // open: RGBout
  numbers_square_object #(.OBJECT_WIDTH_X(16), .OBJECT_HEIGHT_Y(32), .OBJECT_COLOR(8'b01011011), .topLeftX(580), .topLeftY(200)) inst85 (
    .clk(CLOCK_50), .resetN(resetN), .pixelX(pixelX), .pixelY(pixelY), .digit(inst84_result),
    .offsetX(inst85_offsetx), .offsetY(inst85_offsety), .drawingRequest(inst85_drawingrequest),
    .index(inst85_index));  // open: RGBout
  numbers_square_object #(.OBJECT_WIDTH_X(16), .OBJECT_HEIGHT_Y(32), .OBJECT_COLOR(8'b01011011), .topLeftX(600), .topLeftY(200)) inst88 (
    .clk(CLOCK_50), .resetN(resetN), .pixelX(pixelX), .pixelY(pixelY), .digit(inst87_result),
    .offsetX(inst88_offsetx), .offsetY(inst88_offsety), .drawingRequest(inst88_drawingrequest),
    .index(inst88_index));  // open: RGBout
  missle_move #(.INITIAL_X_SPEED(0), .INITIAL_Y_SPEED(0), .MOVEMENT_X_SPEED(500), .MOVEMENT_Y_SPEED(500)) inst21 (
    .clk(CLOCK_50), .resetN(resetN), .startOfFrame(Start_of_frame), .collision(inst32_out),
    .inputKeyPressed(spacePressed), .tankTopLeftX(tank2TLX), .tankTopLeftY(tank2TLY), .tankDir(tank2Dir),
    .topLeftX(missle2TLX), .topLeftY(missle2TLY), .drawEn(inst21_drawen), .dir(missle2Dir));
  tank_move #(.INITIAL_X(500), .INITIAL_Y(400), .INITIAL_X_SPEED(0), .INITIAL_Y_SPEED(0), .MOVEMENT_X_SPEED(80), .MOVEMENT_Y_SPEED(80)) inst23 (
    .clk(CLOCK_50), .resetN(resetN), .startOfFrame(Start_of_frame), .brickCollision(collisionTank2BrickWall),
    .missleCollision(collisionTank2Missle1), .tankCollision(collisionTank1Tank2),
    .inputKeyPressed(keyPressed2), .topLeftX(tank2TLX), .topLeftY(tank2TLY), .tankDir(tank2Dir));
  objects_mux inst13 (
    .clk(CLOCK_50), .resetN(resetN), .tank1DrawingRequest(tank1DrawingRequest), .tank1RGB(tank1RGB),
    .tank2DrawingRequest(tank2DrawingRequest), .tank2RGB(tank2RGB),
    .brickDrawingRequest(matrixDrawingRequest), .brickRGB(matrixRGB),
    .missle1DrawingRequest(missle1DrawingRequest), .missle1RGB(missle1RGB),
    .missle2DrawingRequest(missle2DrawingRequest), .missle2RGB(missle2RGB),
    .buff1DrawingRequest(buff1DrawingRequest), .buff1RGB(buff1RGB),
    .buff2DrawingRequest(buff2DrawingRequest), .buff2RGB(buff2RGB),
    .buff3DrawingRequest(buff3DrawingRequest), .buff3RGB(buff3RGB),
    .buff4DrawingRequest(buff4DrawingRequest), .buff4RGB(buff4RGB),
    .electionDrawingRequest(electionDrawingRequest), .electionRGB(electionRGB),
    .digit1DrawingRequest(digit1DrawingRequest), .digit1RGB(digit1RGB),
    .digit2DrawingRequest(digit2DrawingRequest), .digit2RGB(digit2RGB),
    .digit3DrawingRequest(digit3DrawingRequest), .digit3RGB(digit3RGB),
    .digit4DrawingRequest(digit4DrawingRequest), .digit4RGB(digit4RGB), .backGroundRGB(BG_RGB),
    .redOut(iRed), .greenOut(iGreen), .blueOut(iBlue));
  NumbersBitMap #(.digit_color(8'b11111111)) inst75 (
    .clk(CLOCK_50), .resetN(resetN), .offsetX(inst77_offsetx), .offsetY(inst77_offsety),
    .InsideRectangle(inst77_drawingrequest), .index(inst77_index), .drawingRequest(digit1DrawingRequest),
    .RGBout(digit1RGB));
  NumbersBitMap #(.digit_color(8'b11111111)) inst80 (
    .clk(CLOCK_50), .resetN(resetN), .offsetX(inst82_offsetx), .offsetY(inst82_offsety),
    .InsideRectangle(inst82_drawingrequest), .index(inst82_index), .drawingRequest(digit2DrawingRequest),
    .RGBout(digit2RGB));
  NumbersBitMap #(.digit_color(8'b11111111)) inst83 (
    .clk(CLOCK_50), .resetN(resetN), .offsetX(inst85_offsetx), .offsetY(inst85_offsety),
    .InsideRectangle(inst85_drawingrequest), .index(inst85_index), .drawingRequest(digit3DrawingRequest),
    .RGBout(digit3RGB));
  NumbersBitMap #(.digit_color(8'b11111111)) inst86 (
    .clk(CLOCK_50), .resetN(resetN), .offsetX(inst88_offsetx), .offsetY(inst88_offsety),
    .InsideRectangle(inst88_drawingrequest), .index(inst88_index), .drawingRequest(digit4DrawingRequest),
    .RGBout(digit4RGB));
  tank_square_object #(.OBJECT_WIDTH_X(25), .OBJECT_HEIGHT_Y(25), .OBJECT_COLOR(8'b01011011)) inst27 (
    .clk(CLOCK_50), .resetN(resetN), .pixelX(pixelX), .pixelY(pixelY), .topLeftX(tank2TLX),
    .topLeftY(tank2TLY), .tankDir(tank2Dir), .offsetX(inst27_offsetx), .offsetY(inst27_offsety),
    .drawingRequest(inst27_drawingrequest));  // open: RGBout
  missle_square_object #(.OBJECT_WIDTH_X(25), .OBJECT_HEIGHT_Y(25), .OBJECT_COLOR(8'b01011011)) inst79 (
    .clk(CLOCK_50), .resetN(resetN), .pixelX(pixelX), .pixelY(pixelY), .topLeftX(missle2TLX),
    .topLeftY(missle2TLY), .dir(missle2Dir), .offsetX(inst79_offsetx), .offsetY(inst79_offsety),
    .drawingRequest(inst79_drawingrequest), .RGBout(inst79_rgbout));
  VGA_Controller inst (
    .Red(iRed), .Green(iGreen), .Blue(iBlue), .clk(CLOCK_50), .resetN(resetN), .PixelX(pixelX),
    .PixelY(pixelY), .StartOfFrame(Start_of_frame), .oVGA_R(VGA_R), .oVGA_G(VGA_G), .oVGA_B(VGA_B),
    .oVGA_HS(VGA_HS), .oVGA_VS(VGA_VS), .oVGA_SYNC(VGA_SYNC_N), .oVGA_BLANK(VGA_BLANK_N), .oVGA_CLOCK(VGA_CLK));
  CONST_1 inst34 (.result(inst34_result));
  tankBitMap inst29 (
    .clk(CLOCK_50), .resetN(resetN), .offsetX(inst27_offsetx), .offsetY(inst27_offsety),
    .InsideRectangle(inst27_drawingrequest), .tankNum(inst34_result), .drawingRequest(tank2DrawingRequest),
    .RGBout(tank2RGB));
  and inst19 (inst19_out, inst79_drawingrequest, inst21_drawen);
  missleBitMap inst30 (
    .clk(CLOCK_50), .resetN(resetN), .offsetX(inst79_offsetx), .offsetY(inst79_offsety),
    .InsideRectangle(inst19_out), .drawingRequest(missle2DrawingRequest), .RGBout(missle2RGB));

  // Other names for the same wires on the sheet: clk = CLOCK_50; VgaB[7:0] = VGA_B; vgaBlinkN = VGA_BLANK_N;
  //   vgaClk = VGA_CLK; VgaG[7:0] = VGA_G; VgaHS = VGA_HS; VgaR[7:0] = VGA_R; VgaSyncN = VGA_SYNC_N; VgaVS = VGA_VS

  // Notes on the sheet:
  //   Tank 1 missle move and draw
  //   Tank 2 missle move and draw
  //   KeyBoard
  //   Tank1 movement  and draw
  //   Tank 2 movement  and draw
  //   Bricks matrix controller and draw
  //   VGA contorller + MUX + BACKGROUND
  //   Game Controller
  //   Sound Unit
  //   Output to 7Seg
endmodule
